# EAGLE design nightLight (EAGLE 9.2.0)
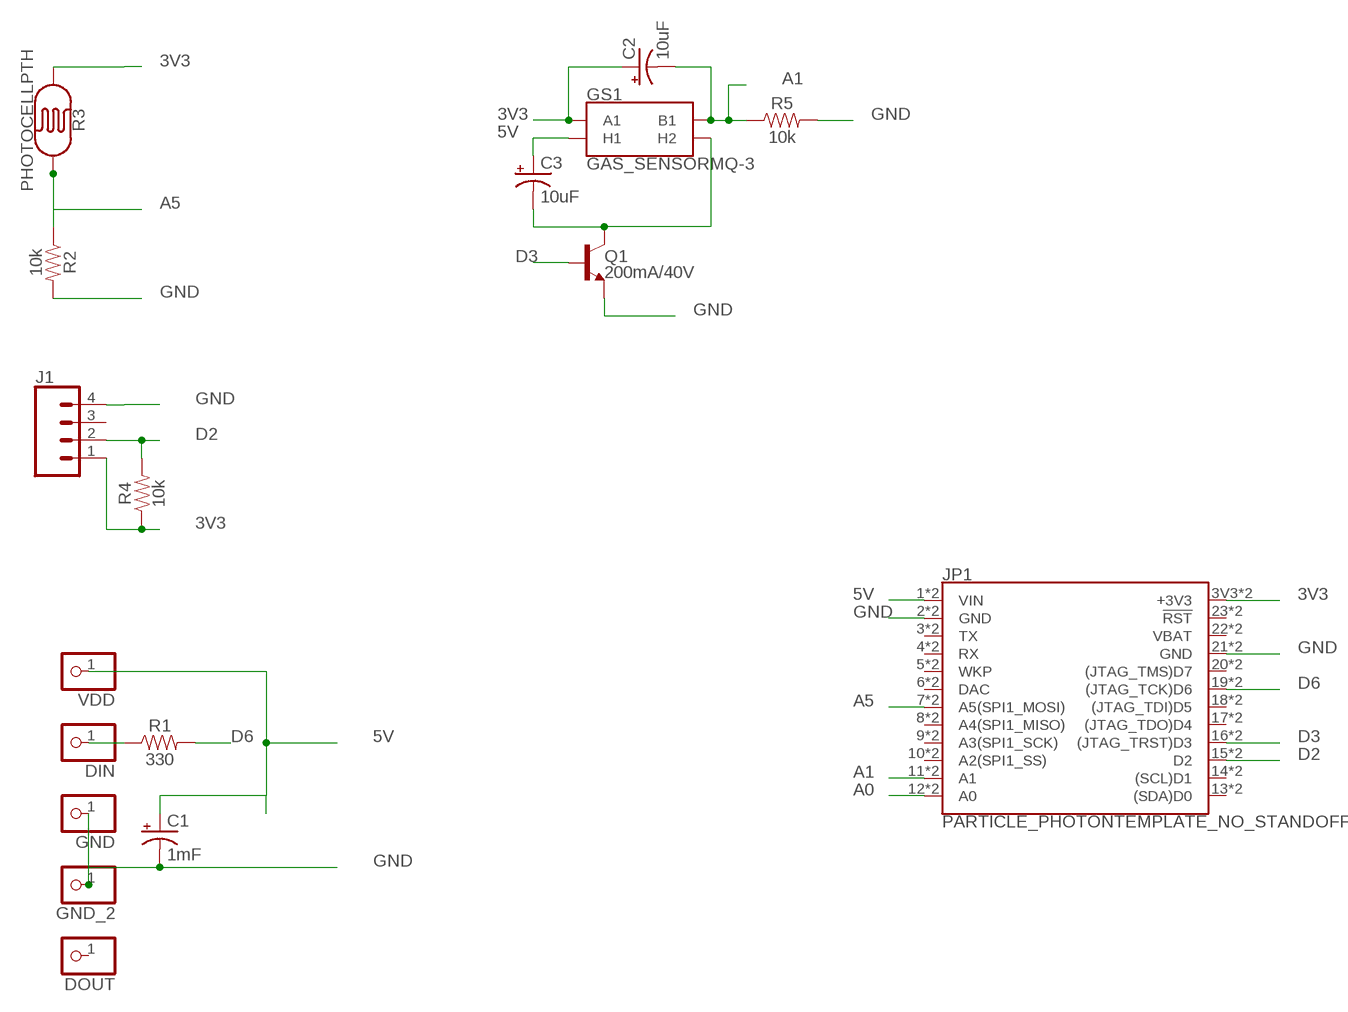
[diagram p0: schematic, sheet 1]

## Parts
C1  1mF  1000UF-RADIAL-5MM-25V-20%  [CPOL-RADIAL-5MM-10MM]
C2  10uF  10UF-POLAR-RADIAL-2.5MM-25V-20%  [CPOL-RADIAL-2.5MM-5MM]
C3  10uF  10UF-POLAR-RADIAL-2.5MM-25V-20%  [CPOL-RADIAL-2.5MM-5MM]
DIN  PINHD-1X1CB  [1X01-CLEANBIG]
DOUT  PINHD-1X1CB  [1X01-CLEANBIG]
GND  PINHD-1X1CB  [1X01-CLEANBIG]
GND_2  PINHD-1X1CB  [1X01-CLEANBIG]
GS1  GAS_SENSORMQ-3  [GAS_SENSOR]
J1  CONN_04  [1X04]
JP1  PARTICLE_PHOTONTEMPLATE_NO_STANDOFF  [PARTICLE_PHOTON_TEMPLATE_NO_STANDOFF]
Q1  200mA/40V  TRANS_NPN-2N3904-EZ  [TO-92-EZ]
R1  330  330OHM-HORIZ-1/10W-5%  [AXIAL-0.3]
R2  10k  10KOHM-HORIZ-1/4W-1%  [AXIAL-0.3]
R3  PHOTOCELLPTH  [PHOTOCELL]
R4  10k  10KOHM-HORIZ-1/4W-1%  [AXIAL-0.3]
R5  10k  10KOHM-HORIZ-1/6W-5%  [AXIAL-0.3]
VDD  PINHD-1X1CB  [1X01-CLEANBIG]

## Nets
3V3: C2.1(+) GS1.A1 J1.1 JP1.3V3(+3V3) JP1.24(+3V3) R3.1 R4.P$1
5V: C1.+ C3.1(+) GS1.HA(H1) JP1.1(VIN) JP1.VIN VDD.1
A0: JP1.12(A0) JP1.A0
A1: C2.2(-) GS1.B1 JP1.11(A1) JP1.A1 R5.P$1
A5: JP1.7(A5(SPI1_MOSI)) JP1.A5(A5(SPI1_MOSI)) R2.P$1 R3.2
D2: J1.2 JP1.15(D2) JP1.D2 R4.P$2
D3: JP1.16((JTAG_TRST)D3) JP1.D3((JTAG_TRST)D3) Q1.2(B)
D6: JP1.19((JTAG_TCK)D6) JP1.D6((JTAG_TCK)D6) R1.P$2
GND: C1.- GND.1 GND_2.1 J1.4 JP1.2(GND) JP1.21(GND) JP1.GND@0(GND) JP1.GND@2(GND) Q1.1(E) R2.P$2 R5.P$2
N$1: DIN.1 R1.P$1
N$2: C3.2(-) GS1.HB(H2) Q1.3(C)
Unconnected: DOUT.1 J1.3 JP1.3(TX) JP1.4(RX) JP1.5(WKP) JP1.6(DAC) JP1.8(A4(SPI1_MISO)) JP1.9(A3(SPI1_SCK)) JP1.10(A2(SPI1_SS)) JP1.13((SDA)D0) JP1.14((SCL)D1) JP1.17((JTAG_TDO)D4) JP1.18((JTAG_TDI)D5) JP1.20((JTAG_TMS)D7) JP1.23(!RST!) JP1.A2(A2(SPI1_SS)) JP1.A3(A3(SPI1_SCK)) JP1.A4(A4(SPI1_MISO)) JP1.D0((SDA)D0) JP1.D1((SCL)D1) JP1.D4((JTAG_TDO)D4) JP1.D5((JTAG_TDI)D5) JP1.D7((JTAG_TMS)D7) JP1.DAC JP1.RST(!RST!) JP1.RX JP1.TX JP1.WKP

## Power pins joined to a net without a drawn wire
VBAT: JP1.22(VBAT) JP1.VBAT

## Library data of the parts
C1 = SparkFun-Capacitors:1000UF: 1,000µF/1mF ceramic capacitors A capacitor is a passive two-terminal electrical component used to store electrical energy temporarily in an electric field. CAP-08070; PROD_ID: CAP-09538
C2 C3 = SparkFun-Capacitors:10UF-POLAR: 10.0µF polarized capacitors A capacitor is a passive two-terminal electrical component used to store electrical energy temporarily in an electric field.; PROD_ID: CAP-08440
DIN DOUT GND GND_2 VDD = NeoPixelRing:PINHD-1X1: Pin header 1x1 for 0.1" spacing With round pins
GS1 = SparkFun-Sensors:GAS_SENSOR: Gas Sensors - MQ-3, MQ-4, MQ-6, MQ-7, MQ-8 Through-hole gas sensors with a heating coil and an analog output. Example Datasheet <https://cdn.sparkfun.com/datasheets/Sensors/Biometric/MQ-3%20ver1.3%20-%20Manual.pdf> SparkFun Products Gas Sensor Breakout Board <https://www.sparkfun.com/products/8891> (BOB-8891) - Breakout board compatible with all gas sensors. Alcohol Gas Sensor - MQ-3 <https://www.sparkfun.com/products/8880> (SEN-08880) Methane CNG Gas Sensor - MQ-4 <https://www.sparkfun.com/products/9404> (SEN-09404) LPG Gas Sensor - MQ-6 <https://www.sparkfun.com/products/9405> (SEN-09405) Carbon Monoxide Sensor - MQ-7 <https://www.sparkfun.com/products/9403> (SEN-09403) Hydrogen Gas Sensor - MQ-8 <https://www.sparkfun.com/products/10916> (SEN-10916); PROD_ID: COMP-12216; SF_ID: SEN-08880
J1 = SparkFun-Connectors:CONN_04: Multi connection point. Often used as Generic Header-pin footprint for 0.1 inch spaced/style header connections On any of the 0.1 inch spaced packages, you can populate with these: Break Away Headers - Straight <https://www.sparkfun.com/products/116> (PRT-00116) Break Away Male Headers - Right Angle <https://www.sparkfun.com/products/553> (PRT-00553) Female Headers <https://www.sparkfun.com/products/115> (PRT-00115) Break Away Headers - Machine Pin <https://www.sparkfun.com/products/117> (PRT-00117) Break Away Female Headers - Swiss Machine Pin <https://www.sparkfun.com/products/743> (PRT-00743) For SCREWTERMINALS and SPRING TERMINALS visit here: Screw Terimnals on SparkFun.com <https://www.sparkfun.com/search/results?term=Screw+Terminals> (5mm/3.5mm/2.54mm spacing) This device is also useful as a general connection point to wire up your design to another part of your project. Our various solder wires solder well into these plated through hole pads. Hook-Up Wire - Assortment (Stranded, 22 AWG) <https://www.sparkfun.com/products/11375> (PRT-11375) Hook-Up Wire - Assortment (Solid Core, 22 AWG) <https://www.sparkfun.com/products/11367> (PRT-11367) View the entire wire category on our website here <https://www.sparkfun.com/categories/141> Special notes: Molex polarized connector foot print use with SKU : PRT-08231 with associated crimp pins and housings. 1MM SMD Version SKU: PRT-10208; PROD_ID: CONN-09696
JP1 = SparkFun-Boards:PARTICLE_PHOTON: Particle Photon Footprint of the Particle Photon that is used as a basis for many Photon shields. SparkFun Products: Particle Photon <https://www.sparkfun.com/products/13764> SparkFun Photon ProtoShield <https://www.sparkfun.com/products/13598> SparkFun Photon micro OLED Shield <https://www.sparkfun.com/products/13628> SparkFun Photon IMU Shield <https://www.sparkfun.com/products/13629> SparkFun Photon Battery Shield <https://www.sparkfun.com/products/13626>
Q1 = SparkFun-DiscreteSemi:TRANS_NPN: NPN transistor Current controlled devices typically used to amplify current or used as a switch. BC547 - COM-08928 <http://www.sparkfun.com/products/8928> (TO-92 45V 100mA) (1.Collector 2.Base 3.Emitter) 2N3904 - COM-00521 <http://www.sparkfun.com/products/521> (TO-92 40V 200mA) (1.Emitter 2.Base 3.Collector) P2N2222A - COM-12852 <http://www.sparkfun.com/products/12852> (TO-92 40V 600mA) (1.Collector 2.Base 3.Emitter); PROD_ID: TRANS-08447
R1 = SparkFun-Resistors:330OHM: 330Ω resistor A resistor is a passive two-terminal electrical component that implements electrical resistance as a circuit element. Resistors act to reduce current flow, and, at the same time, act to lower voltage levels within circuits. - Wikipedia; PROD_ID: RES-8371
R2 R4 = SparkFun-Resistors:10KOHM: 10kΩ resistor A resistor is a passive two-terminal electrical component that implements electrical resistance as a circuit element. Resistors act to reduce current flow, and, at the same time, act to lower voltage levels within circuits. - Wikipedia; PROD_ID: RES-12183
R3 = SparkFun-Sensors:PHOTOCELL: Photocell (Photodetector, Photo Resistor, CdS) This is a very small light sensor. A photocell changes (also called a photodetector, photo resistor, CdS or photoconductive cell) resistance depending on the amount of light it is exposed to. These little sensors make great ambient light triggers (when light in the room turns on, do something). Datasheet <http://cdn.sparkfun.com/datasheets/Sensors/LightImaging/SEN-09088.pdf> SparkFun Products Mini Photocell <https://www.sparkfun.com/products/9088> (SEN-09088); PROD_ID: COMP-09129; SF_ID: SEN-09088
R5 = SparkFun-Resistors:10KOHM: 10kΩ resistor A resistor is a passive two-terminal electrical component that implements electrical resistance as a circuit element. Resistors act to reduce current flow, and, at the same time, act to lower voltage levels within circuits. - Wikipedia; PROD_ID: RES-08375

## Board
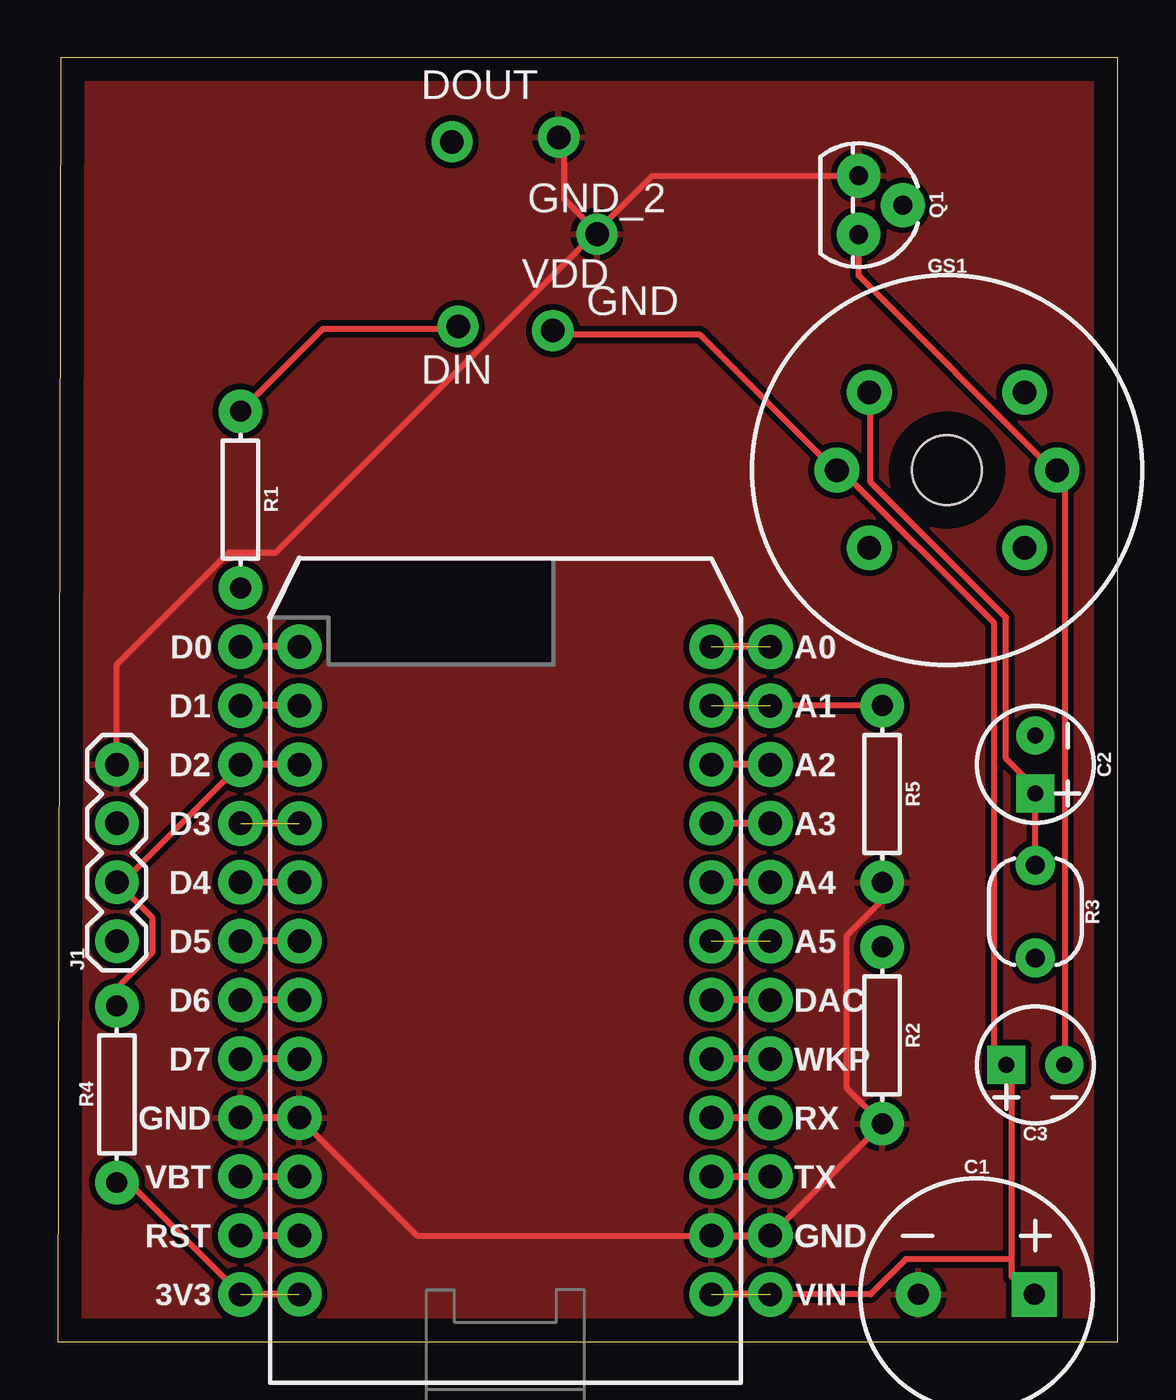
[diagram p1: board, top side]
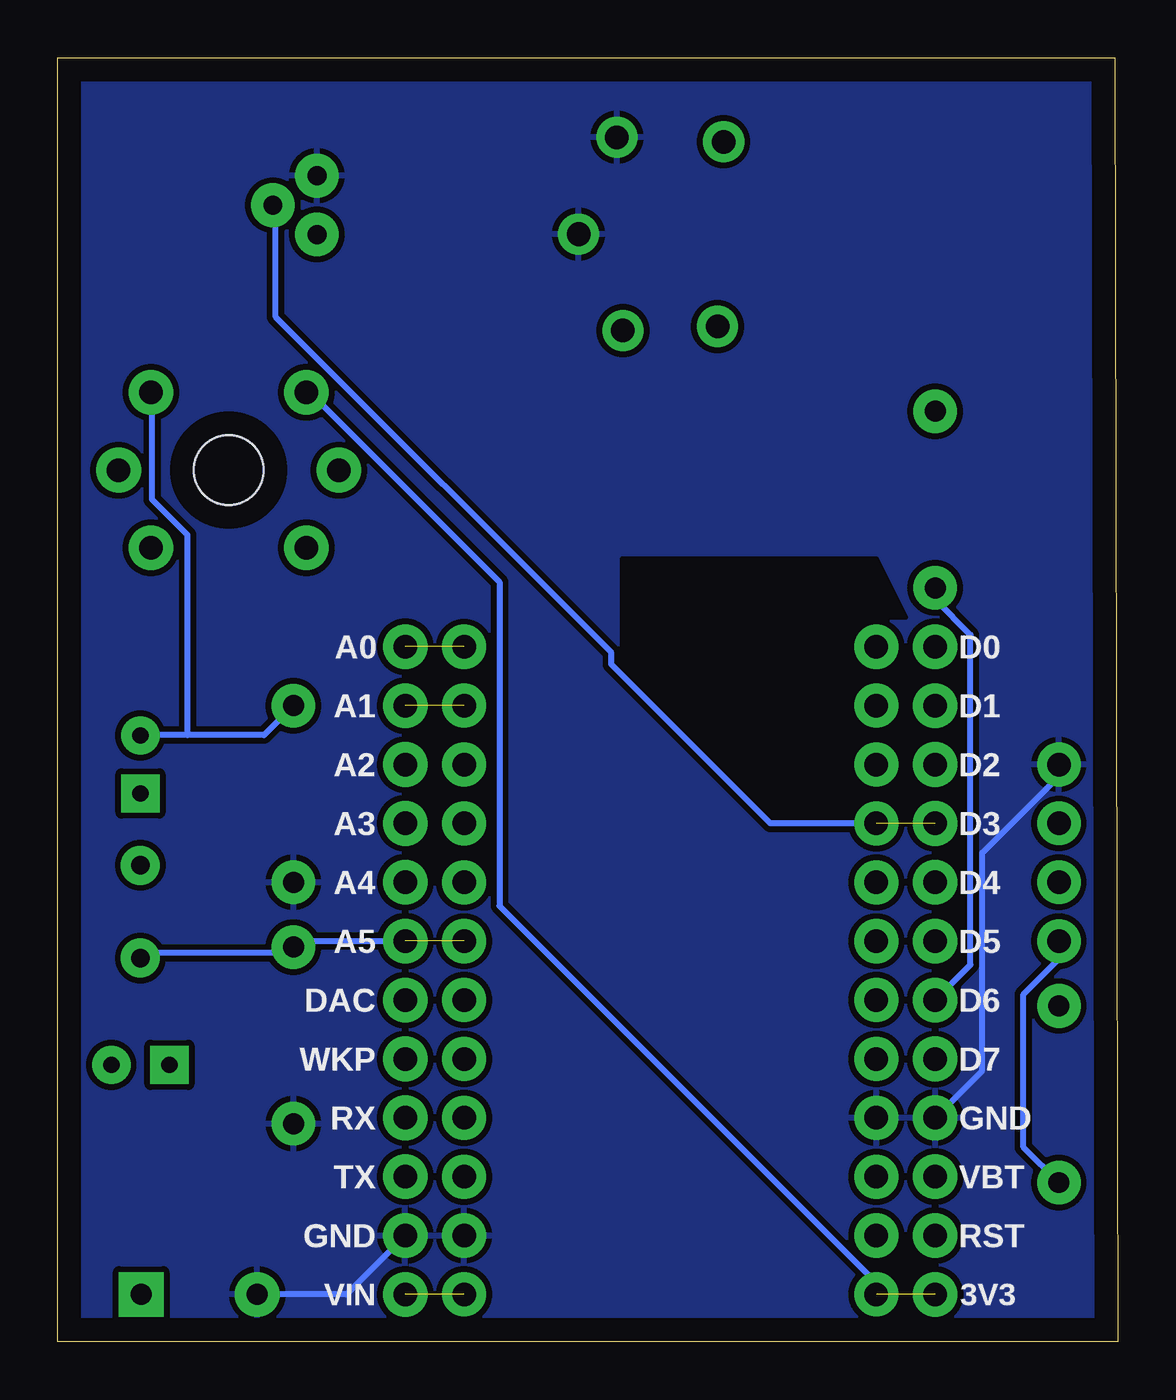
[diagram p2: board, bottom side, seen from below]

Size 45.72 x 55.37 mm. Coordinates in mm from the lower left corner, seen from the top.
Outline: 0,0 45.72,0 45.72,55.37 0.13,55.37 0,0
Copper layers (1*16): Top 0.035mm / dielectric 1.5mm / Bottom 0.035mm
Design rules "default *": minimum track width 10mil, minimum drill 0.4mm, track to track 10mil, track to pad 10mil, pad to pad 6mil, via to via 6mil, smd to smd 6mil, copper to edge 40mil, drill to drill 6mil, minimum pad ring 10mil, minimum via ring 8mil, stop-mask expansion 4mil, vias tented up to drill 0mil, thermal gap 10mil

### Footprints (pad centres in the part's own frame; a part is rotated, then mirrored left to right if it is on the bottom)
CPOL-RADIAL-5MM-10MM = drill 0.9 pad 1.93 square: + 2.5,0 | drill 0.9 pad 1.93: - -2.5,0
CPOL-RADIAL-2.5MM-5MM = drill 0.7 pad 1.651 square: 1 1.25,0 | drill 0.7 pad 1.651: 2 -1.25,0
1X01-CLEANBIG = drill 1.016 pad 1.778: 1 0,0
GAS_SENSOR = drill 1.016 pad 1.93: A1 -3.35,3.35; A2 -3.35,-3.35; B1 3.35,3.35; B2 3.35,-3.35; HA -4.75,0; HB 4.75,0 | hole 3: 0,0
1X04 = drill 1.016 pad 1.88: 1 0,0; 2 2.54,0; 3 5.08,0; 4 7.62,0
PARTICLE_PHOTON_TEMPLATE_NO_STANDOFF = drill 1.016 pad 1.905: 1 -8.89,12.7; 2 -8.89,10.16; 3 -8.89,7.62; 4 -8.89,5.08; 5 -8.89,2.54; 6 -8.89,0; 7 -8.89,-2.54; 8 -8.89,-5.08; 9 -8.89,-7.62; 10 -8.89,-10.16; 11 -8.89,-12.7; 12 -8.89,-15.24; 13 8.89,-15.24; 14 8.89,-12.7; 15 8.89,-10.16; 16 8.89,-7.62; 17 8.89,-5.08; 18 8.89,-2.54; 19 8.89,0; 20 8.89,2.54; 21 8.89,5.08; 22 8.89,7.62; 23 8.89,10.16; 24 8.89,12.7 | drill 1.016 pad 1.93: 3V3 11.43,12.7; A0 -11.43,-15.24; A1 -11.43,-12.7; A2 -11.43,-10.16; A3 -11.43,-7.62; A4 -11.43,-5.08; A5 -11.43,-2.54; D0 11.43,-15.24; D1 11.43,-12.7; D2 11.43,-10.16; D3 11.43,-7.62; D4 11.43,-5.08; D5 11.43,-2.54; D6 11.43,0; D7 11.43,2.54; DAC -11.43,0; GND@0 -11.43,10.16; GND@2 11.43,5.08; RST 11.43,10.16; RX -11.43,5.08; TX -11.43,7.62; VBAT 11.43,7.62; VIN -11.43,12.7; WKP -11.43,2.54
TO-92-EZ = drill 0.813 pad 1.88: 1 -1.27,0; 2 0,1.905; 3 1.27,0
AXIAL-0.3 = drill 0.9 pad 1.88: P$1 -3.81,0; P$2 3.81,0
PHOTOCELL = drill 0.8 pad 1.676: 1 -2,0; 2 2,0

### Placement (x,y rotation side)
C1  39.62,2.03 0 top
C2  42.16,24.89 270 top
C3  42.16,11.94 180 top
DIN  17.26,43.79 0 top
DOUT  17,51.76 0 top
GND  23.26,47.77 0 top
GND_2  21.6,51.95 0 top
GS1  38.35,37.59 0 top
J1  2.54,17.27 90 top
JP1  19.3,14.73 180 top
Q1  34.54,49.02 270 top
R1  7.87,36.32 270 top
R2  35.56,13.21 270 top
R3  42.16,18.54 270 top
R4  2.54,10.67 90 top
R5  35.56,23.62 270 top
VDD  21.35,43.61 0 top

### Tracks (layer width: path | path; a pad name or v marks a point on that pad's centre or on a via)
3V3  (1 unrouted)
  Top 0.254: R4.P$1 3.05,6.86 JP1.3V3 | R3.1 C2.1 42.16,23.88 40.89,25.15 40.89,31.24 35.05,37.08 35.05,40.89 GS1.A1
  Bottom 0.254: J1.1 2.54,16.51 4.06,14.99 4.06,8.38 R4.P$1 | JP1.24 10.41,2.54 26.67,18.8 26.67,32.77 34.8,40.89 GS1.A1
5V  (1 unrouted)
  Top 0.254: VDD.1 21.59,43.43 27.69,43.43 33.53,37.59 GS1.HA 33.78,37.59 40.39,30.99 40.39,12.45 40.89,11.94 C3.1 41.15,11.94 41.15,3.56 | 41.15,3.56 41.15,2.79 41.91,2.03 C1.+ | JP1.VIN 35.05,2.03 36.58,3.56 41.15,3.56
A0  (1 unrouted)
A1  (1 unrouted)
  Top 0.254: R5.P$1 JP1.A1
  Bottom 0.254: 40.13,26.16 36.83,26.16 R5.P$1 | 40.13,26.16 42.16,26.16 C2.2 | 40.13,26.16 40.13,34.8 41.66,36.32 41.66,40.89 GS1.B1
A5  (1 unrouted)
  Bottom 0.254: R3.2 42.16,16.76 35.81,16.76 R2.P$1 35.31,17.27 JP1.A5
D2
  Top 0.254: JP1.15 JP1.D2 2.79,19.81 J1.2 4.06,18.29 4.06,16.76 2.54,15.24 R4.P$2
D3  (1 unrouted)
  Bottom 0.254: JP1.16 14.99,22.35 21.84,29.21 21.84,29.72 36.32,44.2 36.32,49.02 Q1.2
D6
  Top 0.254: JP1.19 JP1.D6
  Bottom 0.254: R1.P$2 7.87,32 6.35,30.48 6.35,16.26 JP1.D6
GND
  Top 0.254: R5.P$2 35.56,19.05 34.04,17.53 34.04,10.92 R2.P$2 JP1.GND@0 JP1.2 15.49,4.57 JP1.21 JP1.GND@2 | GND_2.1 21.84,51.82 21.84,49.28 23.11,48.01 GND.1 | Q1.1 25.65,50.29 23.37,48.01 GND.1 | J1.4 2.54,29.21 7.37,34.04 9.4,34.04 23.11,47.75 GND.1
  Bottom 0.254: C1.- 33.27,2.03 JP1.GND@0 | J1.4 2.54,24.38 5.84,21.08 5.84,11.68 JP1.GND@2
  pour Top: 0.25,0 0.25,55.37 45.72,55.37 45.72,0
  pour Bottom: 0.25,0 45.72,0 45.72,50.04 45.72,55.37 0.25,55.37
N$1
  Top 0.254: R1.P$1 11.43,43.69 17.02,43.69 DIN.1
N$2
  Top 0.254: C3.2 43.43,11.94 43.43,37.34 43.18,37.59 GS1.HB 42.93,37.59 34.54,45.97 Q1.3
VBAT
  Top 0.254: JP1.22 JP1.VBAT